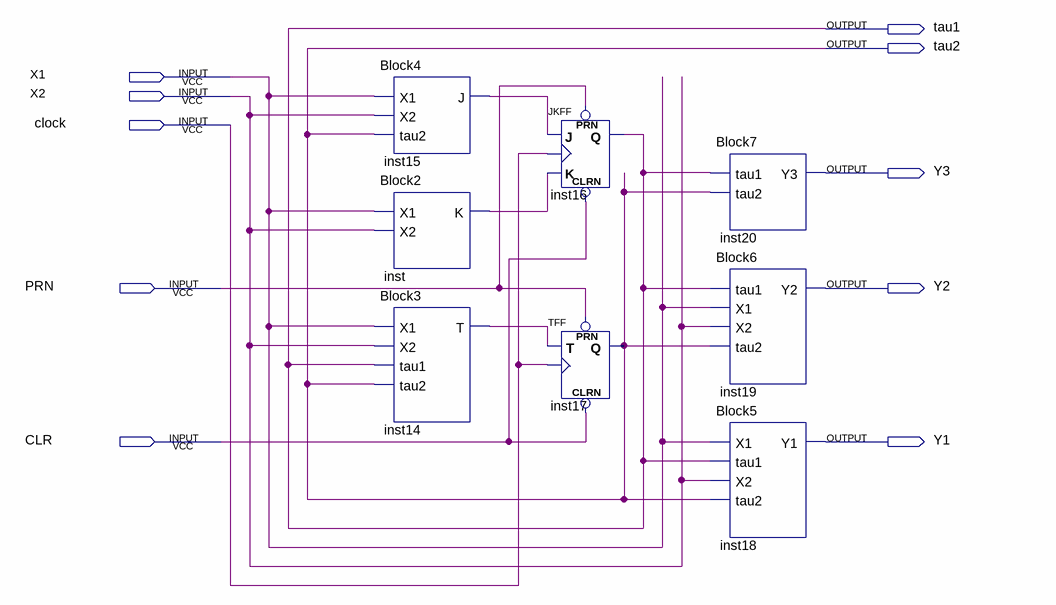
[diagram p0: schematic sheet]
// Quartus schematic Mealy.bdf as structural Verilog: 8 symbols, 10 pins
module Mealy (
  input  X1,
  input  X2,
  input  clock,
  input  PRN,
  input  CLR,
  output tau1,
  output tau2,
  output Y3,
  output Y2,
  output Y1
);

  wire inst14_t, inst15_j, inst_k;

  Block4 inst15 (.X1(X1), .X2(X2), .tau2(tau2), .J(inst15_j));
  Block2 inst (.X1(X1), .X2(X2), .K(inst_k));
  Block3 inst14 (.X1(X1), .X2(X2), .tau1(tau1), .tau2(tau2), .T(inst14_t));
  JKFF inst16 (.PRN(PRN), .CLRN(CLR), .K(inst_k), .J(inst15_j), .CLK(clock), .Q(tau1));
  TFF inst17 (.PRN(PRN), .CLRN(CLR), .T(inst14_t), .CLK(clock), .Q(tau2));
  Block7 inst20 (.tau1(tau1), .tau2(tau2), .Y3(Y3));
  Block6 inst19 (.tau1(tau1), .X1(X1), .X2(X2), .tau2(tau2), .Y2(Y2));
  Block5 inst18 (.X1(X1), .tau1(tau1), .X2(X2), .tau2(tau2), .Y1(Y1));
endmodule
